# Altium schematic sheet edge_dff_clk_high.SchDoc
size A4
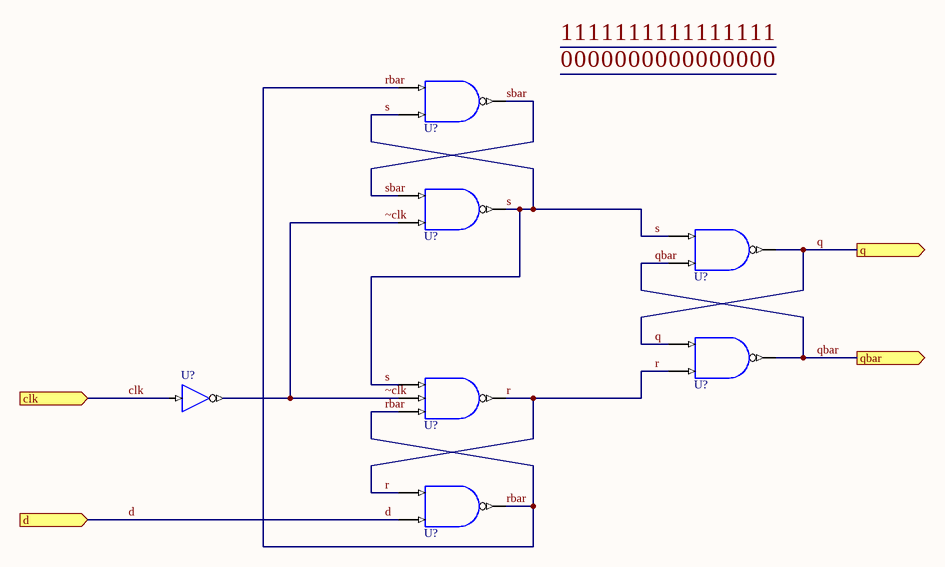
[diagram p0: edge_dff_clk_high.SchDoc]

## Parts
(Parts that share a designator on the sheet are numbered #1, #2 ... from top to bottom, then left to right.)
U?#1  AND 2  (value not drawn)
U?#2  AND 2  (value not drawn)
U?#3  AND 2  (value not drawn)
U?#4  AND 2  (value not drawn)
U?#5  NAND_3  (value not drawn)
U?#6  BUF_inv  (value not drawn)
U?#7  AND 2  (value not drawn)

## Ports
clk (in), d (in), q (out), qbar (out)

## Nets
clk: U?#6.I ; port clk
d: U?#7.B ; port d
q: U?#3.Y U?#4.A ; port q
qbar: U?#3.B U?#4.Y ; port qbar
r: U?#4.B U?#5.Y U?#7.A
rbar: U?#1.A U?#5.C U?#7.Y
s: U?#1.B U?#2.Y U?#3.A U?#5.A
sbar: U?#1.Y U?#2.A
~clk: U?#2.B U?#5.B U?#6.O

## Library data of the parts
U?#1-U?#4 U?#7 = AND_2: 2 Input AND
U?#5 = NAND_3: 3 Input NAND 1 Not
U?#6 = BUF_inv: 1-bit General Purpose (Non-inverting) Buffer